# EAGLE design Lollo_Roco_43840_21MTC_J2_021_02_04 (EAGLE 5.10)

## Sheet 1 of 2
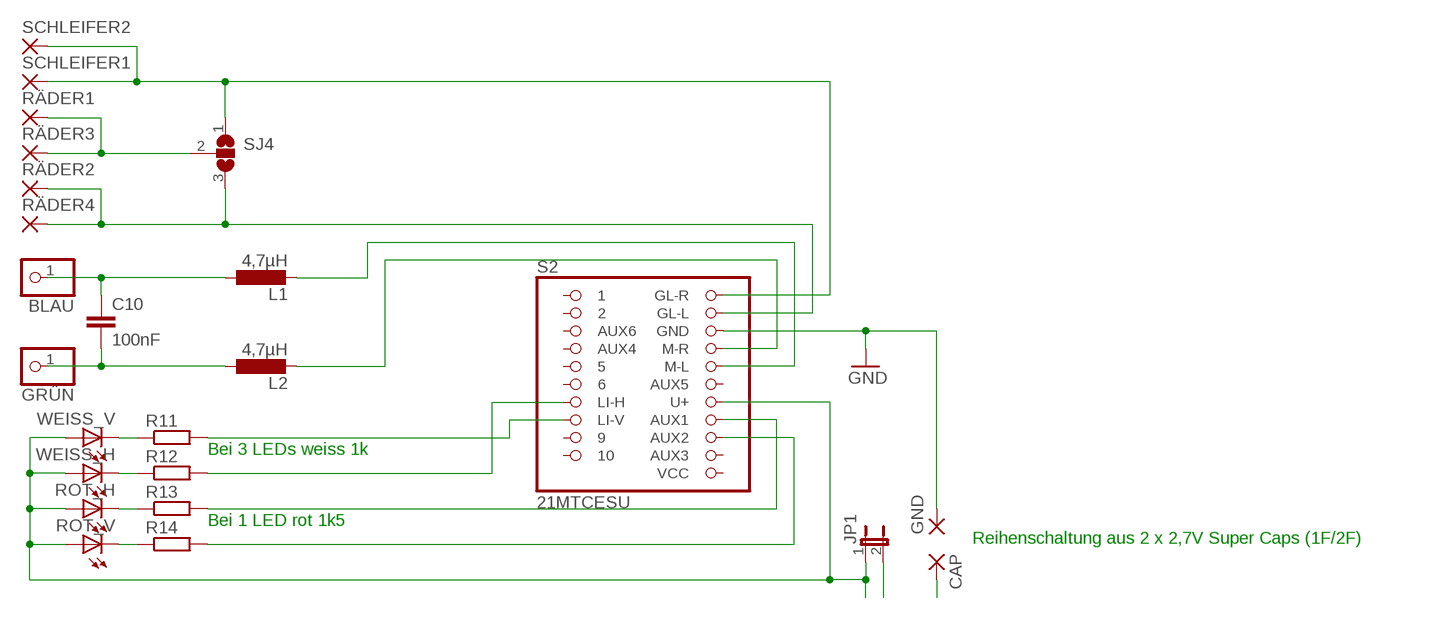
[diagram p0: schematic, sheet 1]

### Parts
BLAU  PINHD-1X1  [1X01]
C10  100nF  C-EUC0603  [C0603]
CAP  SMD2  [SMD1,27-2,54]
GND  SMD2  [SMD1,27-2,54]
GRÜN  PINHD-1X1  [1X01]
JP1  JP1E2,00  [JP1_2]
L1  4,7µH  L-EUL1212  [L1212]
L2  4,7µH  L-EUL1212  [L1212]
R11  R-EU_R0603S  [R0603S]
R12  R-EU_R0603S  [R0603S]
R13  R-EU_R0603S  [R0603S]
R14  R-EU_R0603S  [R0603S]
ROT_H  LG_T679-F1G2-1  [PLCC2]
ROT_V  LG_T679-F1G2-1  [PLCC2]
RÄDER1  SMD2  [SMD1,27-2,54]
RÄDER2  SMD2  [SMD1,27-2,54]
RÄDER3  SMD2  [SMD1,27-2,54]
RÄDER4  SMD2  [SMD1,27-2,54]
S2  21MTCESU  [21MTC_SMD_ESU]
SCHLEIFER1  SMD2  [SMD1,27-2,54]
SCHLEIFER2  SMD2  [SMD1,27-2,54]
SJ4  SJ2W  [SJ_2]
WEISS_H  LG_T679-F1G2-1  [PLCC2]
WEISS_V  LG_T679-F1G2-1  [PLCC2]

### Nets
AUX1: R13.2 S2.P15(AUX1)
AUX2: R14.2 S2.P14(AUX2)
BLAU: BLAU.1 C10.1 L1.1
CAP: CAP.1(P) ; also sheet 2
GELB: R12.2 S2.P7(LI-H)
GND: GND.1(P) S2.P20(GND) ; also sheet 2
GRAU: R11.2 S2.P8(LI-V)
GRÜN: C10.2 GRÜN.1 L2.1
IN: JP1.2 ; also sheet 2
N$1: R11.1 WEISS_V.C
N$2: R12.1 WEISS_H.C
N$3: R13.1 ROT_H.C
N$4: R14.1 ROT_V.C
N$22: L2.2 S2.P19(M-R)
N$23: L1.2 S2.P18(M-L)
ORANGE: JP1.1 ROT_H.A ROT_V.A S2.P16(U+) WEISS_H.A WEISS_V.A
RÄDER: RÄDER2.1(P) RÄDER4.1(P) S2.P21(GL-L) SJ4.3
RÄDER2: RÄDER1.1(P) RÄDER3.1(P) SJ4.2
SCHLEIFER: S2.P22(GL-R) SCHLEIFER1.1(P) SCHLEIFER2.1(P) SJ4.1
Unconnected: S2.P1 S2.P2 S2.P3(AUX6) S2.P4(AUX4) S2.P5 S2.P6 S2.P9 S2.P10 S2.P13(AUX3) S2.P17(AUX5)

### Notes on the sheet
- Bei 3 LEDs weiss 1k
- Bei 1 LED rot 1k5
- Reihenschaltung aus 2 x 2,7V Super Caps (1F/2F)

## Sheet 2 of 2
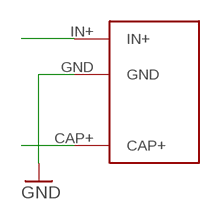
[diagram p1: schematic, sheet 2]

### Parts
U$1  PWR_CAPT  [POWER_CAP]

### Nets
CAP: U$1.CAP+ ; also sheet 1
GND: U$1.GND ; also sheet 1
IN: U$1.IN+ ; also sheet 1

## Power pins joined to a net without a drawn wire
VCC: S2.P12(VCC)

## Library data of the parts
BLAU GRÜN = pinhead:PINHD-1X1: PIN HEADER
C10 = rcl:C-EU: CAPACITOR, European symbol
CAP GND RÄDER1-RÄDER4 SCHLEIFER1 SCHLEIFER2 = wirepad:SMD2: SMD PAD
JP1 = jumper:JP1E: JUMPER
L1 L2 = rcl:L-EU: INDUCTOR, European symbol
R11-R14 = rcl:R-EU_: RESISTOR, European symbol
ROT_H ROT_V WEISS_H WEISS_V = led:*_T679-?-1: LC TOPLED® Low Current LED Source: http://catalog.osram-os.com .. LG_LS_LY_T679_OBS.pdf; COLOR: green
S2 = pinhead:21MTC
SJ4 = jumper:SJ2W: SMD solder JUMPER
U$1 = pinhead:PWR_CAP

## Board
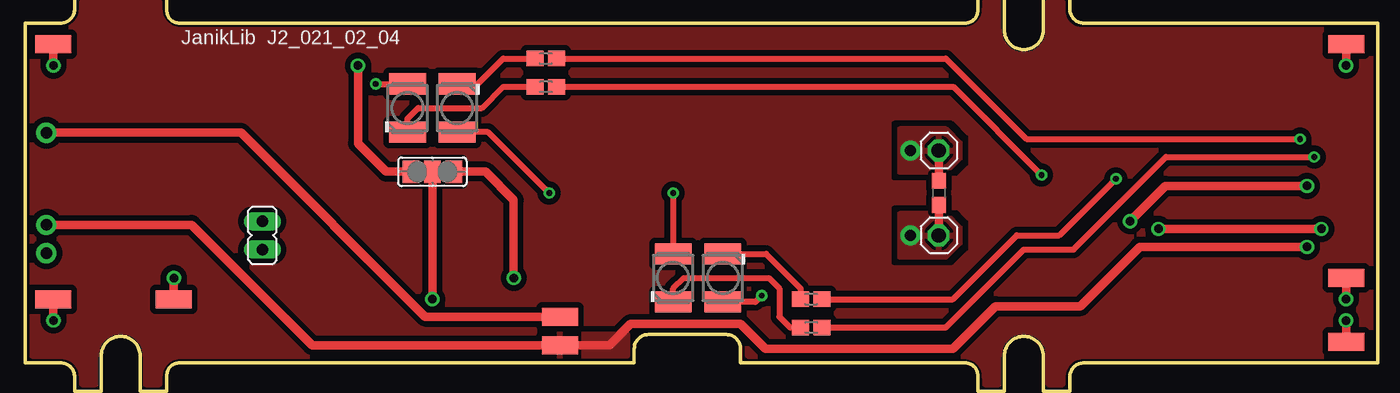
[diagram p2: board, top side]
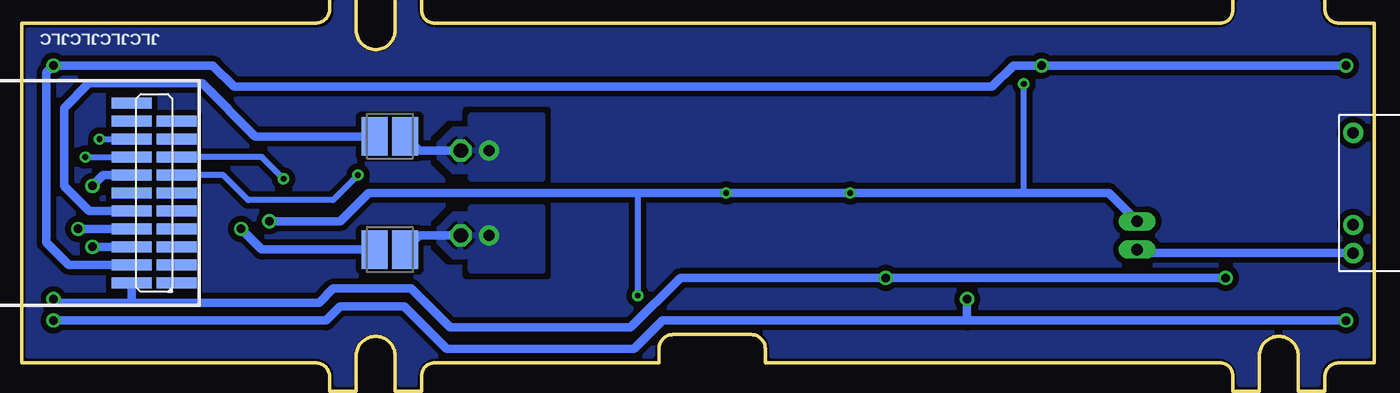
[diagram p3: board, bottom side, seen from below]

No outline drawn. Coordinates in mm, seen from the top.
Copper layers (1*16): Top 0.035mm / dielectric 1.5mm / Bottom 0.035mm
Design rules "default *": minimum track width 10mil, minimum drill 0.4mm, track to track 8mil, track to pad 8mil, pad to pad 8mil, via to via 8mil, smd to smd 8mil, copper to edge 40mil, drill to drill 8mil, minimum pad ring 10mil, minimum via ring 8mil, stop-mask expansion 4mil, vias tented up to drill 0mil, thermal gap 10mil
Milling: 49 lines

### Footprints (pad centres in the part's own frame; a part is rotated, then mirrored left to right if it is on the bottom)
1X01 = drill 1.016 octagon: 1 0,0
C0603 = smd 1.1 x 1: 1 -0.85,0; 2 0.85,0
SMD1,27-2,54 = smd 1.27 x 2.54: 1 0,0
JP1_2 = drill 0.8 long: 1 0,-1; 2 0,1
L1212 = smd 1.85 x 2.7: 1 -1.075,0; 2 1.075,0
R0603S = smd 1.2 x 1.1: 1 -0.75,0; 2 0.75,0
PLCC2 = smd 2.6 x 1.5: A 0,1.7; C 0,-1.7
21MTC_SMD_ESU = smd 0.75 x 2.8: P1 -6.35,-0.953; P2 -5.08,-0.953; P3 -3.81,-0.953; P4 -2.54,-0.953; P5 -1.27,-0.953; P6 0,-0.953; P7 1.27,-0.953; P8 2.54,-0.953; P9 3.81,-0.953; P10 5.08,-0.953; P12 6.35,2.223; P13 5.08,2.223; P14 3.81,2.223; P15 2.54,2.223; P16 1.27,2.223; P17 0,2.223; P18 -1.27,2.223; P19 -2.54,2.223; P20 -3.81,2.223; P21 -5.08,2.223; P22 -6.35,2.223
SJ_2 = smd 1.168 x 1.6: 1 -1.524,0; 2 0,0; 3 1.524,0
POWER_CAP = drill 0.8 pad 1.422 round: CAP+ 0,-6.5; GND 0,0; IN+ 0,2

### Placement (x,y rotation side)
BLAU  61,17 0 top
C10  61,14 270 top
CAP  34.25,5.25 90 top
GND  34.25,3.25 90 top
GRÜN  61,11 0 top
JP1  13.25,11 180 top
L1  66,18 180 bottom
L2  66,10 180 bottom
R11  52,6.5 0 top
R12  33.25,21.5 0 top
R13  52,4.5 0 top
R14  33.25,23.5 0 top
ROT_H  42.25,8 0 top
ROT_V  27,20 180 top
RÄDER1  -1.5,6.5 90 top
RÄDER2  -1.5,24.5 90 top
RÄDER3  89.75,3.5 90 top
RÄDER4  89.75,24.5 90 top
S2  82,14 90 bottom
SCHLEIFER1  7,6.5 90 top
SCHLEIFER2  89.75,8 90 top
SJ4  25.25,15.5 180 top
U$1  -2,11.75 180 bottom
WEISS_H  23.5,20 0 top
WEISS_V  45.75,8 180 top

### Tracks (layer width: path | path; a pad name or v marks a point on that pad's centre or on a via)
AUX1  (via drill 0.4)
  Top 0.406: v87.5,16.54 77.04,16.54 70.5,10 67,10 61.5,4.5 R13.2
  Bottom 0.406: v87.5,16.54 S2.P15
AUX2  (via drill 0.4)
  Top 0.406: v86.5,17.81 67.19,17.81 61.5,23.5 R14.2
  Bottom 0.406: v86.5,17.81 S2.P14
BLAU  (via drill 0.8 pad 1.42)
  Top 0.61: C10.1 BLAU.1
  Bottom 0.61: BLAU.1 63.92,17 L1.1
  other vias: 59,17
  pour Top (isolate 0.406): 58.25,15.5 61.5,15.5 62.5,16.5 62.5,17.5 61.5,18.5 58.25,18.5
  pour Bottom (isolate 0.406): 60.25,15 60.25,15.5 61.5,15.5 62.5,16.5 62.5,17.5 61.5,18.5 60.25,18.5 60.25,19.5 55.25,19.5 55.25,15
CAP
  Top 0.61: U$1.CAP+ 11.75,18.25 24.75,5.25 CAP.1
GELB  (via drill 0.4)
  Top 0.406: v68.25,15.27 62.02,21.5 R12.2
  Bottom 0.406: S2.P7 77.77,15.27 76,13.5 70.02,13.5 v68.25,15.27
GND  (via drill 0.6)
  Top 0.61: U$1.GND 8.25,11.75 16.75,3.25 GND.1 37.75,3.25 39.25,4.75 47,4.75 48.75,3 62,3 65,6 71,6 75.19,10.19 v87,10.19
  Bottom 0.61: v87,10.19 S2.P20
  pour Top: 33,4 39,4 39,2.5 33,2.5
GRAU  (via drill 0.4)
  Top 0.406: v73.5,15 69.5,11 66.5,11 62,6.5 R11.2
  Bottom 0.406: v73.5,15 75.04,16.54 S2.P8
GRÜN  (via drill 0.8 pad 1.42)
  Top 0.61: GRÜN.1 C10.2
  Bottom 0.61: GRÜN.1 63.92,11 L2.1
  other vias: 59,11
  pour Top (isolate 0.406): 58.25,9.5 61.5,9.5 62.5,10.5 62.5,11.5 61.5,12.5 58.25,12.5
  pour Bottom (isolate 0.406): 60.25,8.5 60.25,9.5 61.5,9.5 62.5,10.5 62.5,11.5 61.5,12.5 60.25,12.5 60.25,13 55.25,13 55.25,8.5
IN
  Bottom 0.61: JP1.2 13,9.75 U$1.IN+
N$1
  Top 0.406: R11.1 51.25,7.25 48.8,9.7 WEISS_V.C
N$2
  Top 0.406: R12.1 30.25,21.5 28.75,20 24.25,20 23.5,19.25 WEISS_H.C
N$3
  Top 0.406: ROT_H.C 42.25,7.25 43,8 49,8 49.75,7.25 49.75,5.25 50.5,4.5 R13.1
N$4
  Top 0.406: R14.1 30.25,23.5 28.45,21.7 ROT_V.C
N$13
  pour Top (isolate 0.406, rank 2): 6,27.5 0.5,27.5 0.5,27 arc-90 -1,25.5 -3,25.5 -3,2.5 -1,2.5 arc-90 0.5,1 0.5,0.5 1.5,0.5 1.5,2.5 arc-90 3.25,4.25 arc-90 5,2.5 5,0.5 6,0.5 6,1 arc-90 7.5,2.5 39,2.5 39,3 arc-90 40.5,4.5 46,4.5 arc-90 47.5,3 47.5,2.5 62.75,2.5 arc-90 64.25,1 64.25,0.5 65.25,0.5 65.25,2.5 arc-90 67,4.25 arc-90 68.75,2.5 68.75,0.5 69.75,0.5 69.75,1 arc-90 71.25,2.5 91.5,2.5 91.5,25.5 71.25,25.5 arc-90 69.75,26.75 69.75,27.5 68.75,27.5 68.75,25.5 arc-90 67,23.75 arc-90 65.25,25.5 65.25,27.5 64.25,27.5 64.25,27 arc-90 62.75,25.5 7.5,25.5 arc-90 6,27
  pour Bottom (isolate 0.406, rank 2): 6,27.5 0.5,27.5 0.5,27 arc-90 -1,25.5 -3,25.5 -3,2.5 -1,2.5 arc-90 0.5,1 0.5,0.5 1.5,0.5 1.5,2.5 arc-90 3.25,4.25 arc-90 5,2.5 5,0.5 6,0.5 6,1 arc-90 7.5,2.5 39,2.5 39,3 arc-90 40.5,4.5 46,4.5 arc-90 47.5,3 47.5,2.5 62.75,2.5 arc-90 64.25,1 64.25,0.5 65.25,0.5 65.25,2.5 arc-90 67,4.25 arc-90 68.75,2.5 68.75,0.5 69.75,0.5 69.75,1 arc-90 71.25,2.5 91.5,2.5 91.5,25.5 71.25,25.5 arc-90 69.75,26.75 69.75,27.5 68.75,27.5 68.75,25.5 arc-90 67,23.75 arc-90 65.25,25.5 65.25,27.5 64.25,27.5 64.25,27 arc-90 62.75,25.5 7.5,25.5 arc-90 6,27
N$22  (via drill 0.6)
  Top 0.61: v76.5,11.46 v88,11.46
  Bottom 0.61: v88,11.46 S2.P19 | L2.2 75.04,10 v76.5,11.46
N$23
  Bottom 0.61: S2.P18 87.23,12.73 89,14.5 89,20 87.25,21.75 79.25,21.75 75.5,18 L1.2
ORANGE  (via drill 0.4, 0.6)
  Top 0.406: v21.25,21.7 WEISS_H.A | v33.5,14 29.2,18.3 ROT_V.A | v42.25,14 ROT_H.A | WEISS_V.A 48.05,6.3 v48.5,6.75
  Top 0.61: v87,14.5 77,14.5 v74.5,12
  Bottom 0.406: 21.25,14 v21.25,21.7 | 48.5,14 v48.5,6.75
  Bottom 0.61: JP1.1 15.25,14 21.25,14 v33.5,14 v42.25,14 48.5,14 67.5,14 69.5,12 v74.5,12 | S2.P16 86.23,15.27 v87,14.5
RÄDER  (via drill 0.6)
  Top 0.61: RÄDER2.1 v-1.5,23 | v89.75,23 RÄDER4.1 | SJ4.3 22,15.5 20,17.5 v20,23
  Bottom 0.61: S2.P21 88.67,8.92 90.25,10.5 90.25,22.5 v89.75,23 78.5,23 77,21.5 23.5,21.5 22,23 v20,23 v-1.5,23
RÄDER2  (via drill 0.6)
  Top 0.61: v89.75,5 RÄDER3.1 | v-1.5,5 RÄDER1.1 | v25.25,6.5 SJ4.2
  Bottom 0.61: v-1.5,5 25.25,5 | 25.25,5 46.75,5 48.75,3 62,3 65,6 69.5,6 70.5,5 v89.75,5 | 25.25,5 v25.25,6.5
SCHLEIFER  (via drill 0.6)
  Top 0.61: SJ4.1 29,15.5 31,13.5 v31,8 | SCHLEIFER1.1 v7,8 | v89.75,6.5 SCHLEIFER2.1
  Bottom 0.61: v7,8 v31,8 45.5,8 49,4.5 61.75,4.5 64.5,7.25 70,7.25 71,6.25 84.22,6.25 | v89.75,6.5 89.5,6.25 84.22,6.25 | 84.22,6.25 S2.P22

### Text on the board
tNames: JanikLib J2_021_02_04
bNames: JLCJLCJLCJLC
tStop: Rad1 | Rad1 | Roco 43840 | Lollo 21MTC | design by Janik Merz | AC | DC | CAP | Schl. | CAP+ | Rad2 | Schl. | GND | Rad2
bStop: 21MTC